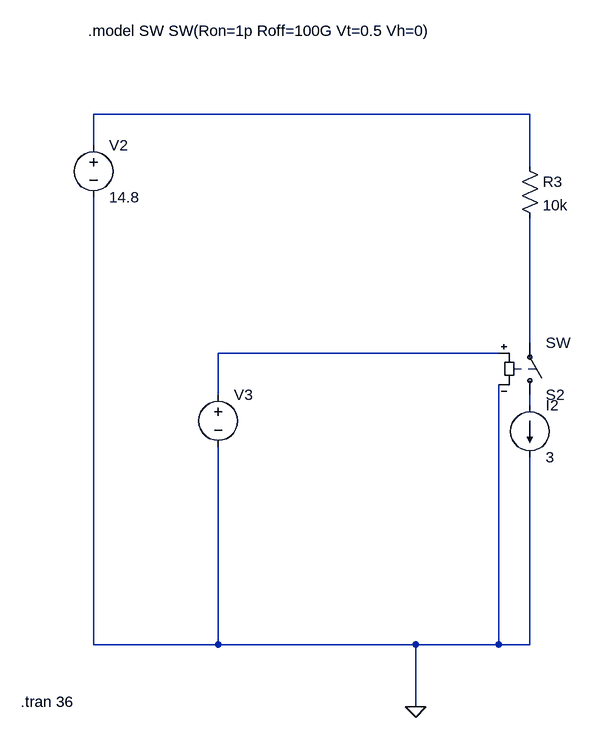
[diagram p0: schematic Switch.asc]
Switch.asc, the LTspice schematic file:
Version 4
SHEET 1 2092 1124
WIRE -944 192 -1616 192
WIRE -1616 240 -1616 192
WIRE -944 272 -944 192
WIRE -944 544 -944 352
WIRE -992 560 -1424 560
WIRE -1424 624 -1424 560
WIRE -944 640 -944 624
WIRE -1616 1008 -1616 320
WIRE -1424 1008 -1424 704
WIRE -1424 1008 -1616 1008
WIRE -1120 1008 -1424 1008
WIRE -992 1008 -992 608
WIRE -992 1008 -1120 1008
WIRE -944 1008 -944 720
WIRE -944 1008 -992 1008
WIRE -1120 1104 -1120 1008
FLAG -1120 1104 0
SYMBOL sw -944 640 M180
SYMATTR InstName S2
SYMBOL res -960 256 R0
SYMATTR InstName R3
SYMATTR Value 10k
SYMBOL voltage -1616 224 R0
WINDOW 123 0 0 Left 0
WINDOW 39 0 0 Left 0
SYMATTR InstName V2
SYMATTR Value 14.8
SYMBOL voltage -1424 608 R0
WINDOW 3 24 96 Invisible 2
WINDOW 123 0 0 Left 0
WINDOW 39 0 0 Left 0
SYMATTR Value PULSE(0 5 10 1n 1n 5 10 1)
SYMATTR InstName V3
SYMBOL load2 -944 640 R0
WINDOW 123 0 0 Left 0
WINDOW 39 0 0 Left 0
SYMATTR InstName I2
SYMATTR Value 3
TEXT -1624 64 Left 2 !.model SW SW(Ron=1p Roff=100G Vt=0.5 Vh=0)
TEXT -1728 1096 Left 2 !.tran 36

The netlist it stands for:
* Switch.asc
S2 N004 N002 N003 0 SW
R3 N001 N002 10k
V2 N001 0 14.8
V3 N003 0 PULSE(0 5 10 1n 1n 5 10 1)
I2 N004 0 3
.model SW SW(Ron=1p Roff=100G Vt=0.5 Vh=0)
.tran 36
.backanno
.end